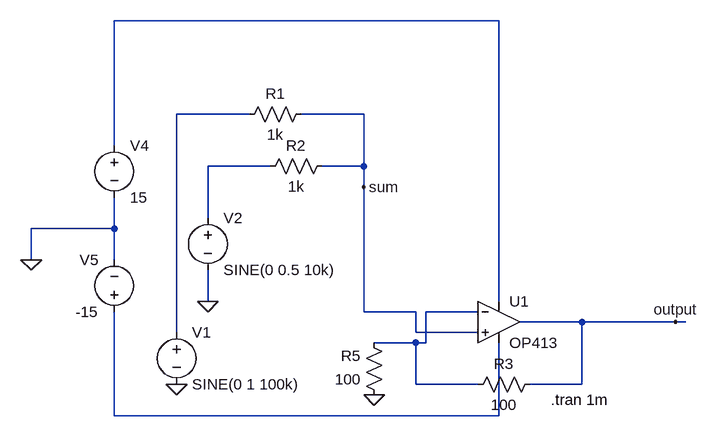
[diagram p0: schematic mixer_noninverting_op_amp.asc]
mixer_noninverting_op_amp.asc, the LTspice schematic file:
Version 4
SHEET 1 1196 680
WIRE 208 -320 -384 -320
WIRE -176 -176 -288 -176
WIRE 0 -176 -96 -176
WIRE -384 -128 -384 -320
WIRE -144 -96 -240 -96
WIRE 0 -96 0 -176
WIRE 0 -96 -64 -96
WIRE 0 -64 0 -96
WIRE -240 -16 -240 -96
WIRE -384 0 -384 -48
WIRE -384 0 -512 0
WIRE -512 48 -512 0
WIRE -384 48 -384 0
WIRE -240 112 -240 64
WIRE 208 112 208 -320
WIRE 0 128 0 -64
WIRE 80 128 0 128
WIRE 176 128 96 128
WIRE 336 144 240 144
WIRE 480 144 336 144
WIRE 496 144 480 144
WIRE -288 160 -288 -176
WIRE 80 160 80 128
WIRE 176 160 80 160
WIRE 80 176 16 176
WIRE 96 176 96 128
WIRE 96 176 80 176
WIRE 80 240 80 176
WIRE 176 240 80 240
WIRE 336 240 336 144
WIRE 336 240 256 240
WIRE -384 288 -384 128
WIRE 208 288 208 176
WIRE 208 288 -384 288
FLAG -512 48 0
FLAG -240 112 0
FLAG -288 240 0
FLAG 480 144 output
FLAG 0 -64 sum
FLAG 16 256 0
SYMBOL voltage -384 -144 R0
WINDOW 123 0 0 Left 0
WINDOW 39 0 0 Left 0
SYMATTR InstName V4
SYMATTR Value 15
SYMBOL voltage -384 144 R180
WINDOW 0 24 96 Left 2
WINDOW 3 24 16 Left 2
WINDOW 123 0 0 Left 0
WINDOW 39 0 0 Left 0
SYMATTR InstName V5
SYMATTR Value -15
SYMBOL voltage -288 144 R0
WINDOW 123 0 0 Left 0
WINDOW 39 0 0 Left 0
SYMATTR InstName V1
SYMATTR Value SINE(0 1 100k)
SYMBOL voltage -240 -32 R0
WINDOW 123 0 0 Left 0
WINDOW 39 0 0 Left 0
SYMATTR InstName V2
SYMATTR Value SINE(0 0.5 10k)
SYMBOL res -80 -192 R90
WINDOW 0 0 56 VBottom 2
WINDOW 3 32 56 VTop 2
SYMATTR InstName R1
SYMATTR Value 1k
SYMBOL res -48 -112 R90
WINDOW 0 0 56 VBottom 2
WINDOW 3 32 56 VTop 2
SYMATTR InstName R2
SYMATTR Value 1k
SYMBOL Opamps\\OP413 208 80 R0
SYMATTR InstName U1
SYMBOL res 272 224 R90
WINDOW 0 0 56 VBottom 2
WINDOW 3 32 56 VTop 2
SYMATTR InstName R3
SYMATTR Value 100
SYMBOL res 32 272 R180
WINDOW 0 36 76 Left 2
WINDOW 3 36 40 Left 2
SYMATTR InstName R5
SYMATTR Value 100
TEXT 288 264 Left 2 !.tran 1m

The netlist it stands for:
* mixer_noninverting_op_amp.asc
V4 N001 0 15
V5 N005 0 -15
V1 N002 0 SINE(0 1 100k)
V2 N003 0 SINE(0 0.5 10k)
R1 sum N002 1k
R2 sum N003 1k
XU1 sum N004 N001 N005 output OP413  ; pins In+ In- V+ V- OUT
R3 output N004 100
R5 0 N004 100
.tran 1m
.backanno
.end